# EAGLE schematic EDC-1 (EAGLE 9.6.2)
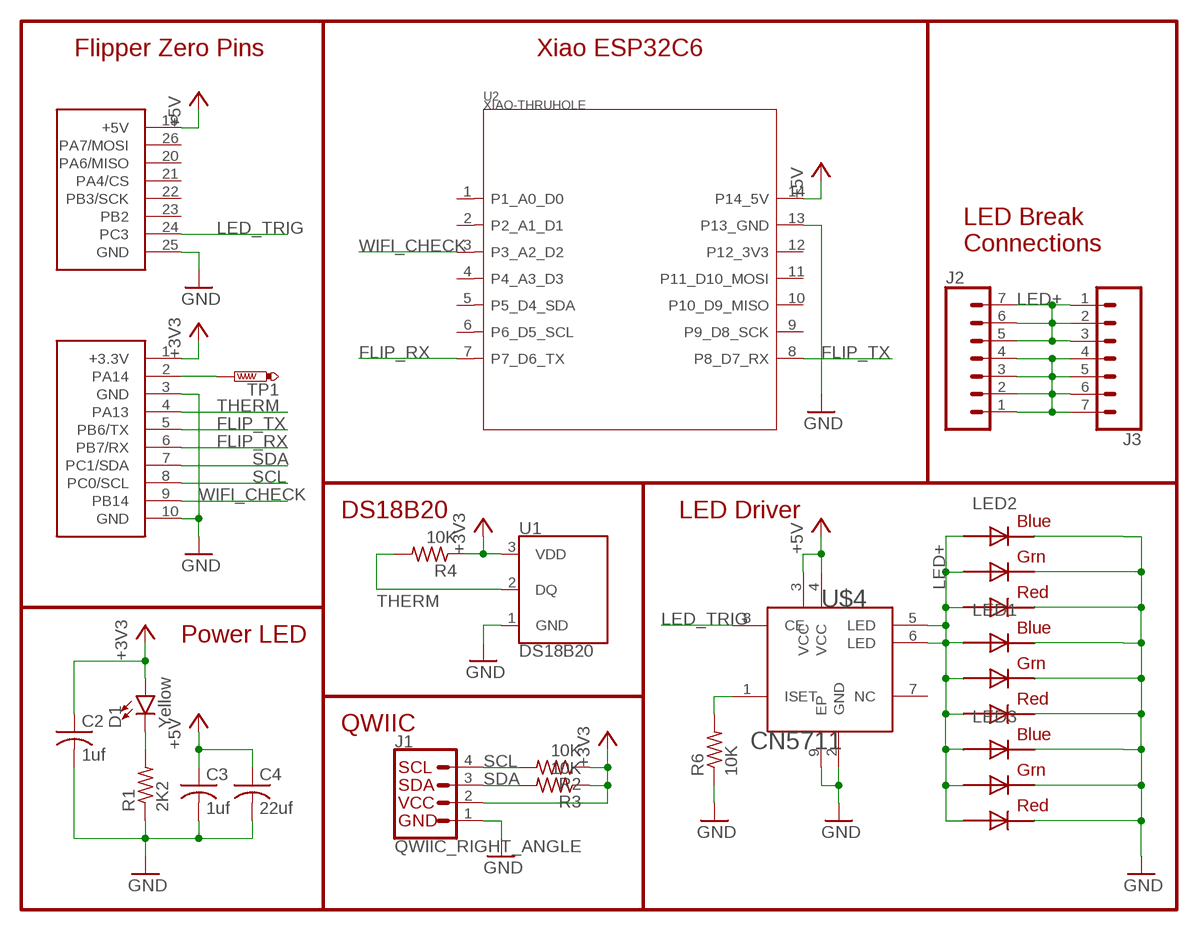
[diagram p0: schematic, sheet 1]

## Parts
C2  1uf  C-USC0805  [C0805]
C3  1uf  C-USC0805  [C0805]
C4  22uf  C-USC3216  [C3216]
D1  Yellow  LED-YELLOWLILYPAD  [LED-1206]
J1  QWIIC_RIGHT_ANGLE  QWIIC_CONNECTORJS-1MM  [JST04_1MM_RA]
J2  CONN_07LONGPADS  [1X07_LONGPADS]
J3  CONN_07LONGPADS  [1X07_LONGPADS]
LED1  RGBLED5050  [RGBLED5050]
LED2  RGBLED5050  [RGBLED5050]
LED3  RGBLED5050  [RGBLED5050]
R1  2K2  R-US_R0805  [R0805]
R2  10K  R-US_R0805  [R0805]
R3  10K  R-US_R0805  [R0805]
R4  10K  R-US_R0805  [R0805]
R6  10K  R-US_R0805  [R0805]
TP1  PTR1PAD1-13  [P1-13]
U1  DS18B20  [TO-92-AMMO]
U2  XIAO-THRUHOLE  [XIAO-GENERIC-THRUHOLE-MODULE14P-2.54-21X17.8MM]
U$1  BOTH-SMD  [BOTH-SMD]
U$4  CN5711  [SOIC127P600X175-9N]

## Nets
+3V3: C2.1 D1.A J1.2 R2.1 R3.1 R4.1 U1.3(VDD) U$1.1(+3.3V)
+5V: C3.1 C4.1 U2.14(P14_5V) U$1.19(+5V) U$4.3(VCC) U$4.4(VCC)
FLIP_RX: U2.7(P7_D6_TX) U$1.6(PB7/RX)
FLIP_TX: U2.8(P8_D7_RX) U$1.5(PB6/TX)
GND: C2.2 C3.2 C4.2 J1.1 J2.1 J2.2 J2.3 J2.4 J3.4 J3.5 J3.6 J3.7 LED1.4(BLUE_C) LED1.5(RED_C) LED1.6(GREEN_C) LED2.4(BLUE_C) LED2.5(RED_C) LED2.6(GREEN_C) LED3.4(BLUE_C) LED3.5(RED_C) LED3.6(GREEN_C) R1.1 R6.1 U1.1(GND) U2.13(P13_GND) U$1.3(GND) U$1.10(GND) U$1.25(GND) U$4.2(GND) U$4.9(EP)
LED+: J2.5 J2.6 J2.7 J3.1 J3.2 J3.3 LED1.1(GREEN_A) LED1.2(RED_A) LED1.3(BLUE_A) LED2.1(GREEN_A) LED2.2(RED_A) LED2.3(BLUE_A) LED3.1(GREEN_A) LED3.2(RED_A) LED3.3(BLUE_A) U$4.5(LED) U$4.6(LED)
LED_TRIG: U$1.24(PC3) U$4.8(CE)
N$1: TP1.TP U$1.2(PA14)
N$5: R6.2 U$4.1(ISET)
N$8: D1.C R1.2
SCL: J1.4 R2.2 U$1.8(PC0/SCL)
SDA: J1.3 R3.2 U$1.7(PC1/SDA)
THERM: R4.2 U1.2(DQ) U$1.4(PA13)
WIFI_CHECK: U2.3(P3_A2_D2) U$1.9(PB14)
Unconnected: U2.1(P1_A0_D0) U2.2(P2_A1_D1) U2.4(P4_A3_D3) U2.5(P5_D4_SDA) U2.6(P6_D5_SCL) U2.9(P9_D8_SCK) U2.10(P10_D9_MISO) U2.11(P11_D10_MOSI) U2.12(P12_3V3) U$1.20(PA6/MISO) U$1.21(PA4/CS) U$1.22(PB3/SCK) U$1.23(PB2) U$1.26(PA7/MOSI) U$4.7(NC)

## Notes on the sheet
- Flipper Zero Pins | Xiao ESP32C6
- LED Break
  Connections
- DS18B20 | LED Driver
- Power LED
- QWIIC

## Library data of the parts
C2-C4 = rcl:C-US: CAPACITOR, American symbol; SPICEPREFIX: C
D1 = SparkFun-LED:LED-YELLOW: Yellow SMD LED Used in manufacturing several products at SparkFun. Packages: 0603 - SMD 0603 package[Product Link] <http://www.kingbrightusa.com/product.asp?catalog_name=LED&product_id=APT1608SYCK> 0603 -SMART - SMART SMD 0603 package (more efficient/more expensive) [Product Link] <http://www.osram-os.com/osram_os/en/products/product-catalog/led-light-emitting-diodes/smartled-0603/ly-l29k/index.jsp> LilyPad - SMD1206 package[Product Datasheet] <https://www.sparkfun.com/datasheets/DevTools/LilyPad/Q150YUS4.pdf> SparkFun Products: Blynk Board <https://www.sparkfun.com/products/13794> IOIO-OTG <https://www.sparkfun.com/products/13613> XBee Explorer Serial <https://www.sparkfun.com/products/13225>; PROD_ID: DIO-09909
J1 = SparkFun-Connectors:QWIIC_CONNECTOR: SparkFun I2C Standard Qwiic Connector An SMD 1mm pitch JST connector makes it easy and quick (get it? Qwiic?) to connect I2C devices to each other. The Qwiic system <http://www.sparkfun.com/qwiic> enables fast and solderless connection between popular platforms and various sensors and actuators. We carry 200mm <https://www.sparkfun.com/products/14204>, 100mm <https://www.sparkfun.com/products/14205>, 50mm <https://www.sparkfun.com/products/14206>, and breadboard friendly <https://www.sparkfun.com/products/14207> Qwiic cables. We also offer 10 pcs strips <https://www.sparkfun.com/products/14323> the SMD connectors.; PROD_ID: CONN-13694
J2 J3 = SparkFun-Connectors:CONN_07: Multi connection point. Often used as Generic Header-pin footprint for 0.1 inch spaced/style header connections On any of the 0.1 inch spaced packages, you can populate with these: Break Away Headers - Straight <https://www.sparkfun.com/products/116> (PRT-00116) Break Away Male Headers - Right Angle <https://www.sparkfun.com/products/553> (PRT-00553) Female Headers <https://www.sparkfun.com/products/115> (PRT-00115) Break Away Headers - Machine Pin <https://www.sparkfun.com/products/117> (PRT-00117) Break Away Female Headers - Swiss Machine Pin <https://www.sparkfun.com/products/743> (PRT-00743) For SCREWTERMINALS and SPRING TERMINALS visit here: Screw Terimnals on SparkFun.com <https://www.sparkfun.com/search/results?term=Screw+Terminals> (5mm/3.5mm/2.54mm spacing) This device is also useful as a general connection point to wire up your design to another part of your project. Our various solder wires solder well into these plated through hole pads. Hook-Up Wire - Assortment (Stranded, 22 AWG) <https://www.sparkfun.com/products/11375> (PRT-11375) Hook-Up Wire - Assortment (Solid Core, 22 AWG) <https://www.sparkfun.com/products/11367> (PRT-11367) View the entire wire category on our website here <https://www.sparkfun.com/categories/141> Special notes: Molex polarized connector foot print use with SKU : PRT-08231 with associated crimp pins and housings. 1MM SMD Version SKU: PRT-10208 NOTES ON THE VARIANTS LOCK and LOCK_LONGPADS... This footprint was designed to help hold the alignment of a through-hole component (i.e. 6-pin header) while soldering it into place. You may notice that each hole has been shifted either up or down by 0.005 of an inch from it's more standard position (which is a perfectly straight line). This slight alteration caused the pins (the squares in the middle) to touch the edges of the holes. Because they are alternating, it causes a "brace" to hold the component in place. 0.005 has proven to be the perfect amount of "off-center" position when using our standard breakaway headers. Although looks a little odd when you look at the bare footprint, once you have a header in there, the alteration is very hard to notice. Also,if you push a header all the way into place, it is covered up entirely on the bottom side.
LED1-LED3 = adafruit:RGBLED: For 5050 RGB LEDs, the order of the LEDs may vary from one manufacturer to another!
R1-R4 R6 = rcl:R-US_: RESISTOR, American symbol; SPICEPREFIX: R
TP1 = testpad:PTR1: TEST PIN
U1 = DS18B20:DS18B20: Dallas/Maxim DS18B20 1-Wire Temperature Sensor The DS18B20 reports degrees C with 9 to 12-bit precision, -55C to 125C (+/-0.5C). Each sensor has a unique 64-Bit Serial number etched into it - allows for a huge number of sensors to be used on one data bus. Datasheet <http://datasheets.maximintegrated.com/en/ds/DS18B20.pdf> SparkFun Products One Wire Digital Temperature Sensor - DS18B20 <https://www.sparkfun.com/products/245> (SEN-00245) Check availability <https://pricing.snapeda.com/parts/DS18B20/UMW/view-part?ref=eda>; AVAILABILITY: In Stock; CHECK_PRICES: https://www.snapeda.com/parts/DS18B20/UMW/view-part/?ref=eda; DESCRIPTION: Temperature Sensor Digital, Local -55°C ~ 125°C 9 b, 10 b, 11 b, 12 b TO-92; MF: UMW; MP: DS18B20; PACKAGE: None; PRICE: None; SNAPEDA_LINK: https://www.snapeda.com/parts/DS18B20/UMW/view-part/?ref=snap
U2 = Seeed Studio XIAO Series:XIAO-THRUHOLE: Seeed Studio XIAO Series Through-hole Footprint and Symbol Basic through-hole footprint for Seeed XIAO series of boards. The underside surface mount pads are disabled. For through-hole mounting, a pair of 7-pin, 2.54mm pitch headers with 0.64x0.64mm square leads are recommended. The hybrid variant allows the assembler to choose between surface mount and through-hole mounting methods. However, there is a risk of solder leakage and therefore insufficient solder at the joints if soldering using solder paste and stencils, so we advise using this footprint only when the module is intended to be hand soldered. The symbol pin labels are generic. Please refer to the specific board for more information. Seeed Studio XIAO SAMD21 (Seeeduino XIAO) is also available pre-soldered: Seeed Studio XIAO SAMD21 Pre-soldered - Microchip ATSAMD21G18 Arduino Microcontroller with headers Seeed SKU: 102010388 Buy now <https://www.seeedstudio.com/Seeeduino-XIAO-Pre-Soldered-p-4747.html>
U$1 = Flipper-Zero-GPIO-Headers:BOTH-SMD
U$4 = CN5711:CN5711